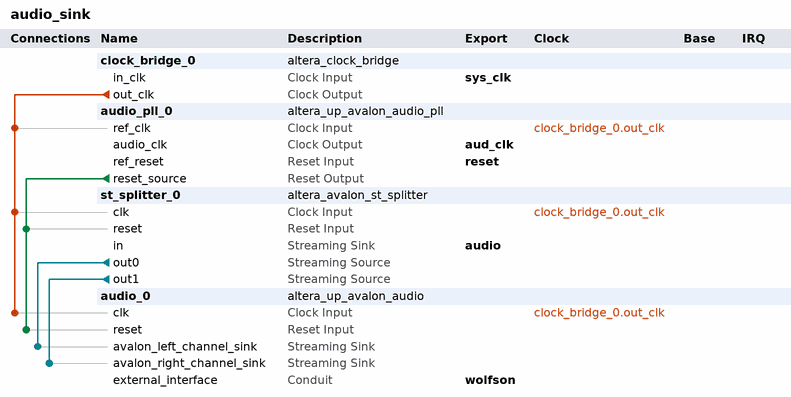
[diagram p0: system contents]
# Platform Designer (Qsys) system audio_sink, Cyclone V 5CSXFC6D6F31C6
# Parameters at their usual value, and those the tool derives, are not listed.
package require -exact qsys 23.1
create_system audio_sink
set_project_property DEVICE_FAMILY {Cyclone V}
set_project_property DEVICE 5CSXFC6D6F31C6

add_instance clock_bridge_0 altera_clock_bridge 23.1
set_instance_parameter_value clock_bridge_0 DERIVED_CLOCK_RATE 0
set_instance_parameter_value clock_bridge_0 EXPLICIT_CLOCK_RATE 0

add_instance audio_pll_0 altera_up_avalon_audio_pll 18.0
set_instance_parameter_value audio_pll_0 gui_refclk 50.0

add_instance st_splitter_0 altera_avalon_st_splitter 23.1
set_instance_parameter_value st_splitter_0 BITS_PER_SYMBOL 8
set_instance_parameter_value st_splitter_0 CHANNEL_WIDTH 1
set_instance_parameter_value st_splitter_0 DATA_WIDTH 24
set_instance_parameter_value st_splitter_0 ERROR_WIDTH 1
set_instance_parameter_value st_splitter_0 MAX_CHANNELS 1
set_instance_parameter_value st_splitter_0 NUMBER_OF_OUTPUTS 2
set_instance_parameter_value st_splitter_0 QUALIFY_VALID_OUT 1
set_instance_parameter_value st_splitter_0 READY_LATENCY 0
set_instance_parameter_value st_splitter_0 USE_CHANNEL 0
set_instance_parameter_value st_splitter_0 USE_DATA 1
set_instance_parameter_value st_splitter_0 USE_ERROR 0
set_instance_parameter_value st_splitter_0 USE_PACKETS 0
set_instance_parameter_value st_splitter_0 USE_READY 1
set_instance_parameter_value st_splitter_0 USE_VALID 1

add_instance audio_0 altera_up_avalon_audio 18.0
set_instance_parameter_value audio_0 audio_in false
set_instance_parameter_value audio_0 avalon_bus_type Streaming
set_instance_parameter_value audio_0 dw 24

# connections
add_connection clock_bridge_0.out_clk audio_0.clk clock
add_connection clock_bridge_0.out_clk audio_pll_0.ref_clk clock
add_connection clock_bridge_0.out_clk st_splitter_0.clk clock
add_connection audio_pll_0.reset_source audio_0.reset reset
add_connection audio_pll_0.reset_source st_splitter_0.reset reset
add_connection st_splitter_0.out0 audio_0.avalon_left_channel_sink avalon_streaming
add_connection st_splitter_0.out1 audio_0.avalon_right_channel_sink avalon_streaming

# exported interfaces
add_interface aud_clk clock source
set_interface_property aud_clk EXPORT_OF audio_pll_0.audio_clk
add_interface audio avalon_streaming sink
set_interface_property audio EXPORT_OF st_splitter_0.in
add_interface reset reset sink
set_interface_property reset EXPORT_OF audio_pll_0.ref_reset
add_interface sys_clk clock sink
set_interface_property sys_clk EXPORT_OF clock_bridge_0.in_clk
add_interface wolfson conduit end
set_interface_property wolfson EXPORT_OF audio_0.external_interface

set_interconnect_requirement {$system} qsys_mm.clockCrossingAdapter HANDSHAKE
set_interconnect_requirement {$system} qsys_mm.enableEccProtection FALSE
set_interconnect_requirement {$system} qsys_mm.insertDefaultSlave FALSE
set_interconnect_requirement {$system} qsys_mm.maxAdditionalLatency 1

save_system audio_sink.qsys
